# Altium project PCB_Project.PrjPcb
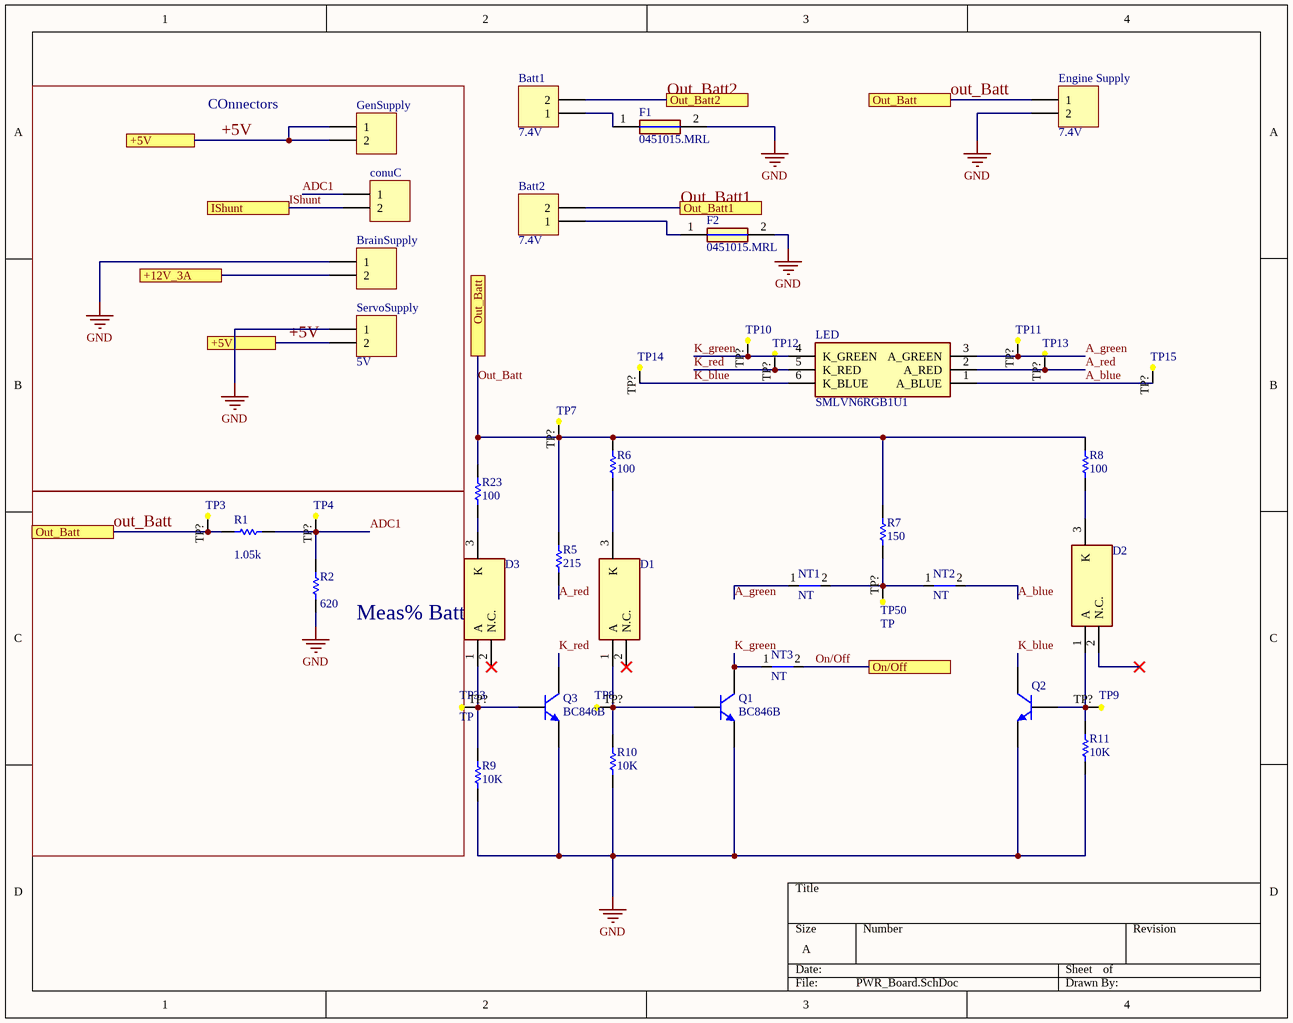
[diagram p0: PWR_Board.SchDoc]
4 sheets, 103 parts. Net scope: flat (ports and power ports of the same name join across sheets).
Board file: PWR_BOard_final.PcbDoc
Sheets:
  PWR_Board.SchDoc
  circuit-On-Off+loudspeaker.SchDoc
  buck_converter15A-5V.schdoc
  Balance_batt_protection.SchDoc

## Sheet PWR_Board.SchDoc
size A; SheetNumber: 5; SheetTotal: 5

### Parts
Batt1  7.4V  [PCBComponent_1 - duplicate]
Batt2  7.4V  [PCBComponent_1 - duplicate]
BrainSupply  6.1V-7.4V  [TB002V50002BE]  (value not drawn)
conuC  6.1V-7.4V  [TB002V50002BE]  (value not drawn)
D1  Vbr=6V2  [SOT65P210X110-3N]  (value not drawn)
D2  BZX84W-C15F  [SOT95P230X110-3N]  (value not drawn)
D3  Vbr=6V2  [SOT95P230X110-3N]  (value not drawn)
Engine_Supply  7.4V  [PCBComponent_1 - duplicate]
F1  0451015.MRL  [FUSC6127X294N]
F2  0451015.MRL  [FUSC6127X294N]
GenSupply  6.1V-7.4V  [TB002V50002BE]  (value not drawn)
LED  SMLVN6RGB1U1  [SMLVN6RGB1U1]
NT1  NT  [NetTie]  (net tie, no BOM)
NT2  NT  [NetTie]  (net tie, no BOM)
NT3  NT  [NetTie]  (net tie, no BOM)
Q1  BC846B  [SOT95P230X110-3N]
Q2  BC846B  [SOT95P230X110-3N]  (value not drawn)
Q3  BC846B  [SOT95P230X110-3N]
R1  value 1.05k  [RESC1608X55N]  (hidden comment: MCR03..PFX1051)
R2  value 620  [RESC1608X55N]  (hidden comment: MCR03...PFX7680)
R5  ERJ2RKF2150..: 215  [ERJ2RKD1004X]  (hidden comment: RK73H1JPT..2150F)
R6  value 100  [RESC1608X55N]  (hidden comment: MCR03..PFX1000)
R7  value 150  [SMM02040D1501BB300]  (hidden comment: SMM0204 50 150R 1 %)
R8  value 100  [RESC1608X55N]  (hidden comment: MCR03..PFX1000)
R9  value 10K  [RESC1608X55N]  (hidden comment: MCR03..PFX1002)
R10  value 10K  [RESC1608X55N]  (hidden comment: MCR03..PFX1002)
R11  value 10K  [RESC1608X55N]  (hidden comment: MCR03..PFX1002)
R23  value 100  [RESC1608X55N]  (hidden comment: MCR03..PFX1000)
ServoSupply  5V  [TB002V50002BE]
TP3  TP  [Test_Point0.5x0.5]  (value not drawn)
TP4  TP  [Test_Point0.5x0.5]  (value not drawn)
TP7  TP  [Test_Point0.5x0.5]  (value not drawn)
TP8  TP  [Test_Point0.5x0.5]  (value not drawn)
TP9  TP  [Test_Point0.5x0.5]  (value not drawn)
TP10  TP  [Test_Point0.5x0.5]  (value not drawn)
TP11  TP  [Test_Point0.5x0.5]  (value not drawn)
TP12  TP  [Test_Point0.5x0.5]  (value not drawn)
TP13  TP  [Test_Point0.5x0.5]  (value not drawn)
TP14  TP  [Test_Point0.5x0.5]  (value not drawn)
TP15  TP  [Test_Point0.5x0.5]  (value not drawn)
TP33  TP  [Test_Point0.5x0.5]
TP50  TP  [Test_Point0.5x0.5]

### Blocks framed on the sheet
COnnectors: BrainSupply conuC GenSupply ServoSupply
Meas% Batt: R1 R2 TP3 TP4

### Ports
+5V, +12V_3A, IShunt, On/Off, Out_Batt, Out_Batt1, Out_Batt2

### Nets
GND: BrainSupply.1 Engine_Supply.2 F1.2 F2.2 Q1.2(E) Q2.2(E) Q3.2(E) R2.2 R9.2 R10.2 R11.2 ServoSupply.1
+5V: GenSupply.1 GenSupply.2 ServoSupply.2 ; port +5V
A_blue: LED.1(A_BLUE) NT2.2 TP15.TP?(TP)
A_green: LED.3(A_GREEN) NT1.1 TP11.TP?(TP)
A_red: LED.2(A_RED) R5.2 TP13.TP?(TP)
ADC1: conuC.1 R1.1 R2.1 TP4.TP?(TP)
IShunt: conuC.2 ; port IShunt
K_blue: LED.6(K_BLUE) Q2.3(C) TP14.TP?(TP)
K_green: LED.4(K_GREEN) NT3.1 Q1.3(C) TP10.TP?(TP)
K_red: LED.5(K_RED) Q3.3(C) TP12.TP?(TP)
On/Off: NT3.2 ; port On/Off
out_Batt: Engine_Supply.1 R1.2 R5.1 R6.1 R7.1 R8.1 R23.1 TP3.TP?(TP) TP7.TP?(TP) ; port Out_Batt
Out_Batt1: Batt2.2 ; port Out_Batt1
Out_Batt2: Batt1.2 ; port Out_Batt2
NetBatt1_1: Batt1.1 F1.1
NetBatt2_1: Batt2.1 F2.1
NetBrainSupply_2: BrainSupply.2 ; port +12V_3A
NetD1_1: D1.1(A) Q1.1(B) R10.1 TP8.TP?(TP)
NetD1_3: D1.3(K) R6.2
NetD2_1: D2.1(A) Q2.1(B) R11.1 TP9.TP?(TP)
NetD2_3: D2.3(K) R8.2
NetD3_1: D3.1(A) Q3.1(B) R9.1 TP33.TP?(TP)
NetD3_3: D3.3(K) R23.2
NetNT1_2: NT1.2 NT2.1 R7.2 TP50.TP?(TP)

Not connected (* = marked no-connect by the designer): D1 2(N.C.)*; D2 2(N.C.)*; D3 2(N.C.)*

### Library data of the parts
Batt1 Batt2 Engine_Supply = Header 2: 2 Holes; LatestRevisionDate: 17-Jul-2002; LatestRevisionNote: Re-released for DXP Platform.; Publisher: Altium Limited
BrainSupply conuC GenSupply ServoSupply = Header 2: Header, 2-Pin; LatestRevisionDate: 17-Jul-2002; LatestRevisionNote: Re-released for DXP Platform.; Publisher: Altium Limited
D1-D3 = BZX84W-C15F: Zener Diode; Manufacturer_Name: Nexperia; Datasheet Link: https://assets.nexperia.com/documents/data-sheet/BZX84W_SER.pdf; Height: 1.1mm; Manufacturer_Part_Number: BZX84W-C15F; Mouser Part Number: 771-BZX84W-C15F; Mouser Price/Stock: https://www.mouser.co.uk/ProductDetail/Nexperia/BZX84W-C15F?qs=MLItCLRbWsyz6DhKLlcnOA%3D%3D; Arrow Part Number: BZX84W-C15F; Arrow Price/Stock: https://www.arrow.com/en/products/bzx84w-c15f/nexperia
F1 F2 = 0451015.MRL: Fuse; Manufacturer_Name: LITTELFUSE; Datasheet Link: http://www.littelfuse.com/~/media/electronics/datasheets/fuses/littelfuse_fuse_451_453_datasheet.pdf.pdf; Height: 2.94mm; Manufacturer_Part_Number: 0451015.MRL; Mouser Part Number: 576-0451015.MRL; Mouser Price/Stock: https://www.mouser.co.uk/ProductDetail/Littelfuse/0451015.MRL?qs=bpnLQM2ZShzZ87Rm5CvzLA%3D%3D; Arrow Part Number: 0451015.MRL; Arrow Price/Stock: https://www.arrow.com/en/products/0451015.mrl/littelfuse?region=europe
LED = SMLVN6RGB1U1: LED; Manufacturer_Name: ROHM Semiconductor; Datasheet Link: https://datasheet.datasheetarchive.com/originals/distributors/DKDS-18/357153.pdf; Height: 0.7mm; Manufacturer_Part_Number: SMLVN6RGB1U1; Mouser Part Number: 755-SMLVN6RGB1U1; Mouser Price/Stock: https://www.mouser.co.uk/ProductDetail/ROHM-Semiconductor/SMLVN6RGB1U1?qs=EAJhGnHnT01cATtJAsda5w%3D%3D; Arrow Part Number: SMLVN6RGB1U1; Arrow Price/Stock: https://www.arrow.com/en/products/smlvn6rgb1u1/rohm-semiconductor
NT1-NT3 = NetTie: Net Tie SMD
Q1-Q3 = NPN: NPN Bipolar Transistor; Published: 8-Jun-2000; LatestRevisionDate: 17-Jul-2002; LatestRevisionNote: Re-released for DXP Platform.; PackageReference: TO-226-AA; Publisher: Altium Limited; PackageDescription: TO, Flat Index; 3 In-Line, Axial Leads; Body Dia. 4.8mm; Leads 0.55 x 0.51 mm (max); Code_JEDEC: TO-226-AA
R1 R2 R5-R11 R23 = Res1: Resistor; Published: 8-Jun-2000; LatestRevisionDate: 17-Jul-2002; LatestRevisionNote: Re-released for DXP Platform.; PackageReference: AXIAL-0.3; Publisher: Altium Limited; PackageDescription: Axial Device, Thru-Hole; 2 Leads; 0.3 in Pin Spacing
TP3 TP4 TP7-TP15 TP33 TP50 = TEst_Point_0.5x0.5

## Sheet circuit-On-Off+loudspeaker.SchDoc
size A; SheetNumber: 4; SheetTotal: 5
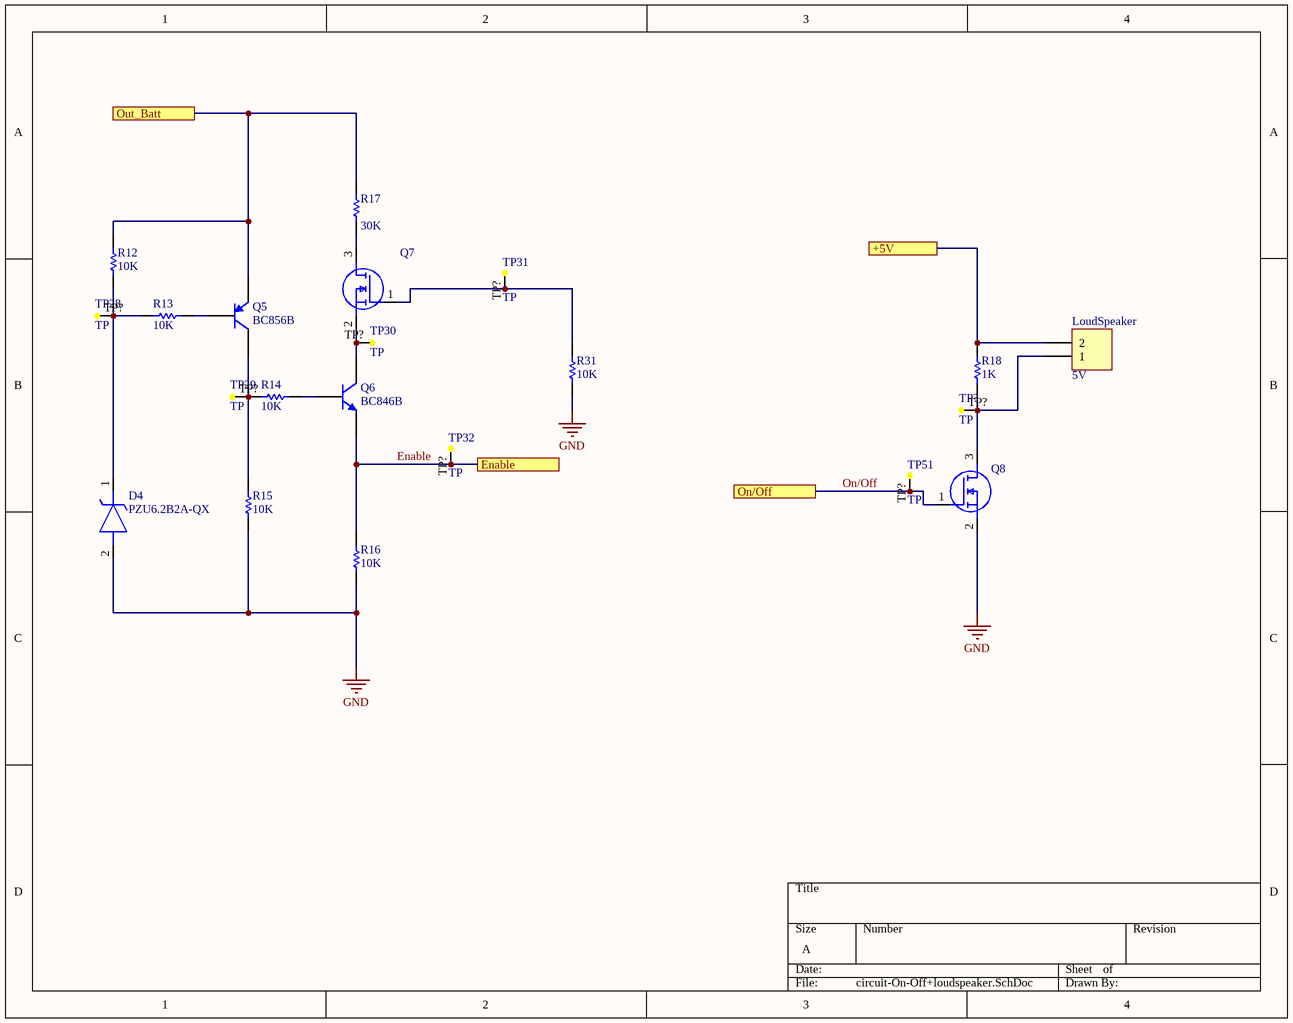
[diagram p1: circuit-On-Off+loudspeaker.SchDoc]

### Parts
D4  PZU6.2B2A-QX  [PZU62B2AQX]
LoudSpeaker  5V  [TB002V50002BE]
Q5  BC856B  [SOT95P230X110-3N]
Q6  BC846B  [SOT95P230X110-3N]
Q7  BSS138BK-215  [SOT95P230X110-3N]  (value not drawn)
Q8  BSS138BK-215  [SOT95P230X110-3N]  (value not drawn)
R12  value 10K  [RESC1608X55N]  (hidden comment: MCR03..PFX1002)
R13  value 10K  [RESC1608X55N]  (hidden comment: MCR03..PFX1002)
R14  value 10K  [RESC1608X55N]  (hidden comment: MCR03..PFX1002)
R15  value 10K  [RESC1608X55N]  (hidden comment: MCR03..PFX1002)
R16  value 10K  [RESC1608X55N]  (hidden comment: MCR03..PFX1002)
R17  value 30K  [ERJ2RKD1004X]  (hidden comment: 8909013012)
R18  value 1K  [ERJP06D1000V]  (hidden comment: MCR03..PFX1002)
R31  value 10K  [RESC1608X55N]  (hidden comment: MCR03..PFX1002)
TP28  TP  [Test_Point0.5x0.5]
TP29  TP  [Test_Point0.5x0.5]
TP30  TP  [Test_Point0.5x0.5]
TP31  TP  [Test_Point0.5x0.5]
TP32  TP  [Test_Point0.5x0.5]
TP51  TP  [Test_Point0.5x0.5]
TP?  TP  [Test_Point0.5x0.5]

### Ports
+5V, Enable, On/Off, Out_Batt

### Nets
GND: D4.2(A) Q8.2(S) R15.2 R16.2 R31.2
+5V: LoudSpeaker.2 R18.1 ; port +5V
Enable: Q6.2(E) R16.1 TP32.TP?(TP) ; port Enable
On/Off: Q8.1(G) TP51.TP?(TP) ; port On/Off
out_Batt: Q5.2(E) R12.1 R17.2 ; port Out_Batt
NetD4_1: D4.1(K) R12.2 R13.1 TP28.TP?(TP)
NetLoudSpeaker_1: LoudSpeaker.1 Q8.3(D) R18.2 TP?.TP?(TP)
NetQ5_1: Q5.1(B) R13.2
NetQ5_3: Q5.3(C) R14.1 R15.1 TP29.TP?(TP)
NetQ6_1: Q6.1(B) R14.2
NetQ6_3: Q6.3(C) Q7.2(S) TP30.TP?(TP)
NetQ7_1: Q7.1(G) R31.1 TP31.TP?(TP)
NetQ7_3: Q7.3(D) R17.1

### Library data of the parts
D4 = PZU6.2B2A-QX: Zener Diode; Manufacturer_Name: Nexperia; Datasheet Link: https://assets.nexperia.com/documents/data-sheet/PZUXBA-Q_SER.pdf; Height: 1.1mm; Manufacturer_Part_Number: PZU6.2B2A-QX
LoudSpeaker = Header 2: Header, 2-Pin; LatestRevisionDate: 17-Jul-2002; LatestRevisionNote: Re-released for DXP Platform.; Publisher: Altium Limited
Q5 = PNP: PNP Bipolar Transistor; Published: 8-Jun-2000; LatestRevisionDate: 29-May-2009; LatestRevisionNote: IPC-7351 Footprint Added.; PackageVersion: Aug-1999; PackageReference: SOT-23B; Publisher: Altium Limited; PackageDescription: 3-Pin SOT-23 Package 0.95 mm Pitch, 2.4 mm Lead Span
Q6 = NPN: NPN Bipolar Transistor; Published: 8-Jun-2000; LatestRevisionDate: 17-Jul-2002; LatestRevisionNote: Re-released for DXP Platform.; PackageReference: TO-226-AA; Publisher: Altium Limited; PackageDescription: TO, Flat Index; 3 In-Line, Axial Leads; Body Dia. 4.8mm; Leads 0.55 x 0.51 mm (max); Code_JEDEC: TO-226-AA
Q7 Q8 = BSS138BK-215: MOSFET (N-Channel); Manufacturer_Name: Nexperia; Datasheet Link: https://assets.nexperia.com/documents/data-sheet/BSS138BK.pdf; Height: 1.1mm; Manufacturer_Part_Number: BSS138BK-215
R12-R18 R31 = Res1: Resistor; Published: 8-Jun-2000; LatestRevisionDate: 17-Jul-2002; LatestRevisionNote: Re-released for DXP Platform.; PackageReference: AXIAL-0.3; Publisher: Altium Limited; PackageDescription: Axial Device, Thru-Hole; 2 Leads; 0.3 in Pin Spacing
TP28-TP32 TP51 TP? = TEst_Point_0.5x0.5

## Sheet buck_converter15A-5V.schdoc
size 515 x 121 mm; SheetNumber: 4; SheetTotal: 5
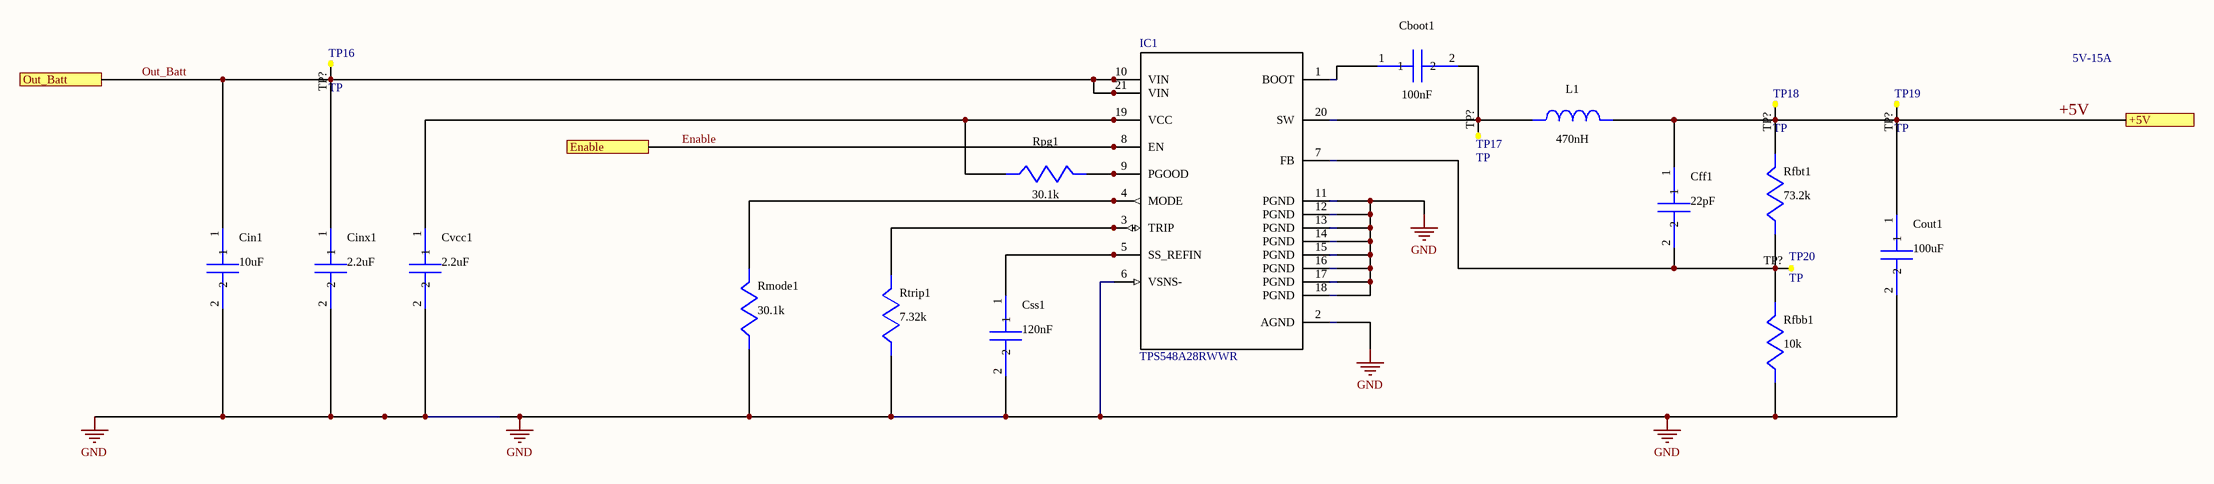
[diagram p2: buck_converter15A-5V.schdoc]

### Parts
Cboot1  value 100nF  [CAPC1005X55N]  (hidden comment: EMK105 B7104KVHF)
Cff1  C1005C0G1H220J: 22pF  [CAPC1005X55N]  (hidden comment: C1005C0G1H220J)
Cin1  value 10uF  [CAPC3216X200N]  (hidden comment: GCJ31CC71E106K)
Cinx1  value 2.2uF  [CAPC1608X80N]  (hidden comment: GCM188C71A225K)
Cout1  value 100uF  [CAPC3225X270N]  (hidden comment: EMK325ABJ107MM-T)
Css1  value 120nF  [CAPC1005X55N]  (hidden comment: C1608X7R1H154K)
Cvcc1  value 2.2uF  [CAPC1608X80N]  (hidden comment: GCM188C71A225K)
IC1  TPS548A28RWWR  [RWW0021A]
L1  value 470nH  [IHLP4040DZERR47M11]  (hidden comment: IHLP4040DZERR47M11)
Rfbb1  value 10k  [SMM02040D1501BB300]  (hidden comment: SMM0204 50 10K 1 %)
Rfbt1  value 73.2k  [ERJ2RKD1004X]  (hidden comment: SMM0204 50 73K2 1 %)
Rmode1  value 30.1k  [SMM02040D1501BB300]  (hidden comment: SMM0204 50 30K1 1 %)
Rpg1  value 30.1k  [SMM02040D1501BB300]  (hidden comment: SMM0204 50 30K1 1 %)
Rtrip1  value 7.32k  [ERJ2RKD1004X]  (hidden comment: SMM0204 50 7K32 1 %)
TP16  TP  [Test_Point0.5x0.5]
TP17  TP  [Test_Point0.5x0.5]
TP18  TP  [Test_Point0.5x0.5]
TP19  TP  [Test_Point0.5x0.5]
TP20  TP  [Test_Point0.5x0.5]

### Ports
+5V, Enable, Out_Batt

### Nets
GND: Cin1.2 Cinx1.2 Cout1.2 Css1.2 Cvcc1.2 IC1.2(AGND) IC1.6(VSNS-) IC1.11(PGND) IC1.12(PGND) IC1.13(PGND) IC1.14(PGND) IC1.15(PGND) IC1.16(PGND) IC1.17(PGND) IC1.18(PGND) Rfbb1.2 Rmode1.2 Rtrip1.2
+5V: Cff1.1 Cout1.1 L1.1 Rfbt1.1 TP18.TP?(TP) TP19.TP?(TP) ; port +5V
Enable: IC1.8(EN) ; port Enable
out_Batt: Cin1.1 Cinx1.1 IC1.10(VIN) IC1.21(VIN) TP16.TP?(TP) ; port Out_Batt
NetCboot1_1: Cboot1.1 IC1.1(BOOT)
NetCboot1_2: Cboot1.2 IC1.20(SW) L1.2 TP17.TP?(TP)
NetCff1_2: Cff1.2 IC1.7(FB) Rfbb1.1 Rfbt1.2 TP20.TP?(TP)
NetCss1_1: Css1.1 IC1.5(SS_REFIN)
NetCvcc1_1: Cvcc1.1 IC1.19(VCC) Rpg1.2
NetIC1_3: IC1.3(TRIP) Rtrip1.1
NetIC1_4: IC1.4(MODE) Rmode1.1
NetIC1_9: IC1.9(PGOOD) Rpg1.1

### Notes on the sheet
- 5V-15A

### Library data of the parts
Cboot1 = EMK107B7104KA-T: Manufacturer Name: Taiyo Yuden; PackageReference: EMK107B7104KA-T; Manufacturer Part Number: EMK107B7104KA-T
Cff1 = C0402C240J3GACTU: Manufacturer Name: Kemet; PackageReference: C0402C240J3GACTU; Manufacturer Part Number: C0402C240J3GACTU
Cin1 = GRM31CR71E106KA12L: GRM31CR71E106KA1; Manufacturer Name: MuRata; PackageReference: GRM31CR71E106KA12L; Manufacturer Part Number: GRM31CR71E106KA12L
Cinx1 = C1608X7R1A225K080AC: C1608X7R1A225K08; Manufacturer Name: TDK; PackageReference: C1608X7R1A225K080AC; Manufacturer Part Number: C1608X7R1A225K080AC
Cout1 = GENERIC_CAPACITOR: CUSTOM1; Manufacturer Name: CUSTOM; PackageReference: CUSTOM; Manufacturer Part Number: GENERIC_CAPACITOR
Css1 = GRM155R61A124KE19D: GRM155R61A124KE1; Manufacturer Name: MuRata; PackageReference: GRM155R61A124KE19D; Manufacturer Part Number: GRM155R61A124KE19D
Cvcc1 = GRM188R71A225KE15D: GRM188R71A225KE1; Manufacturer Name: MuRata; PackageReference: GRM188R71A225KE15D; Manufacturer Part Number: GRM188R71A225KE15D
IC1 = TPS548A28RWWR: No Description Available; Manufacturer: Texas Instruments; PartNumber: TPS548A28RWWR; RefDes: RefDes; TYPE: TYPE; Value: Value; Manufacturer_Part_Number: TPS548A28RWWR; Manufacturer_Name: Texas Instruments; Copyright: Copyright (C) 2018 Accelerated Designs. All rights reserved
L1 = IHLP4040DZERR47M11: IHLP4040DZERR47M; Manufacturer Name: Vishay-Dale; PackageReference: IHLP4040DZERR47M11; Manufacturer Part Number: IHLP4040DZERR47M11
Rfbb1 = CRCW040210K0FKED: Manufacturer Name: Vishay-Dale; PackageReference: CRCW040210K0FKED; Manufacturer Part Number: CRCW040210K0FKED
Rfbt1 = CRCW040273K2FKED: Manufacturer Name: Vishay-Dale; PackageReference: CRCW040273K2FKED; Manufacturer Part Number: CRCW040273K2FKED
Rmode1 Rpg1 = CRCW040230K1FKED: Manufacturer Name: Vishay-Dale; PackageReference: CRCW040230K1FKED; Manufacturer Part Number: CRCW040230K1FKED
Rtrip1 = CRCW04027K32FKED: Manufacturer Name: Vishay-Dale; PackageReference: CRCW04027K32FKED; Manufacturer Part Number: CRCW04027K32FKED
TP16-TP20 = TEst_Point_0.5x0.5

## Sheet Balance_batt_protection.SchDoc
size A; SheetNumber: 1; SheetTotal: 5
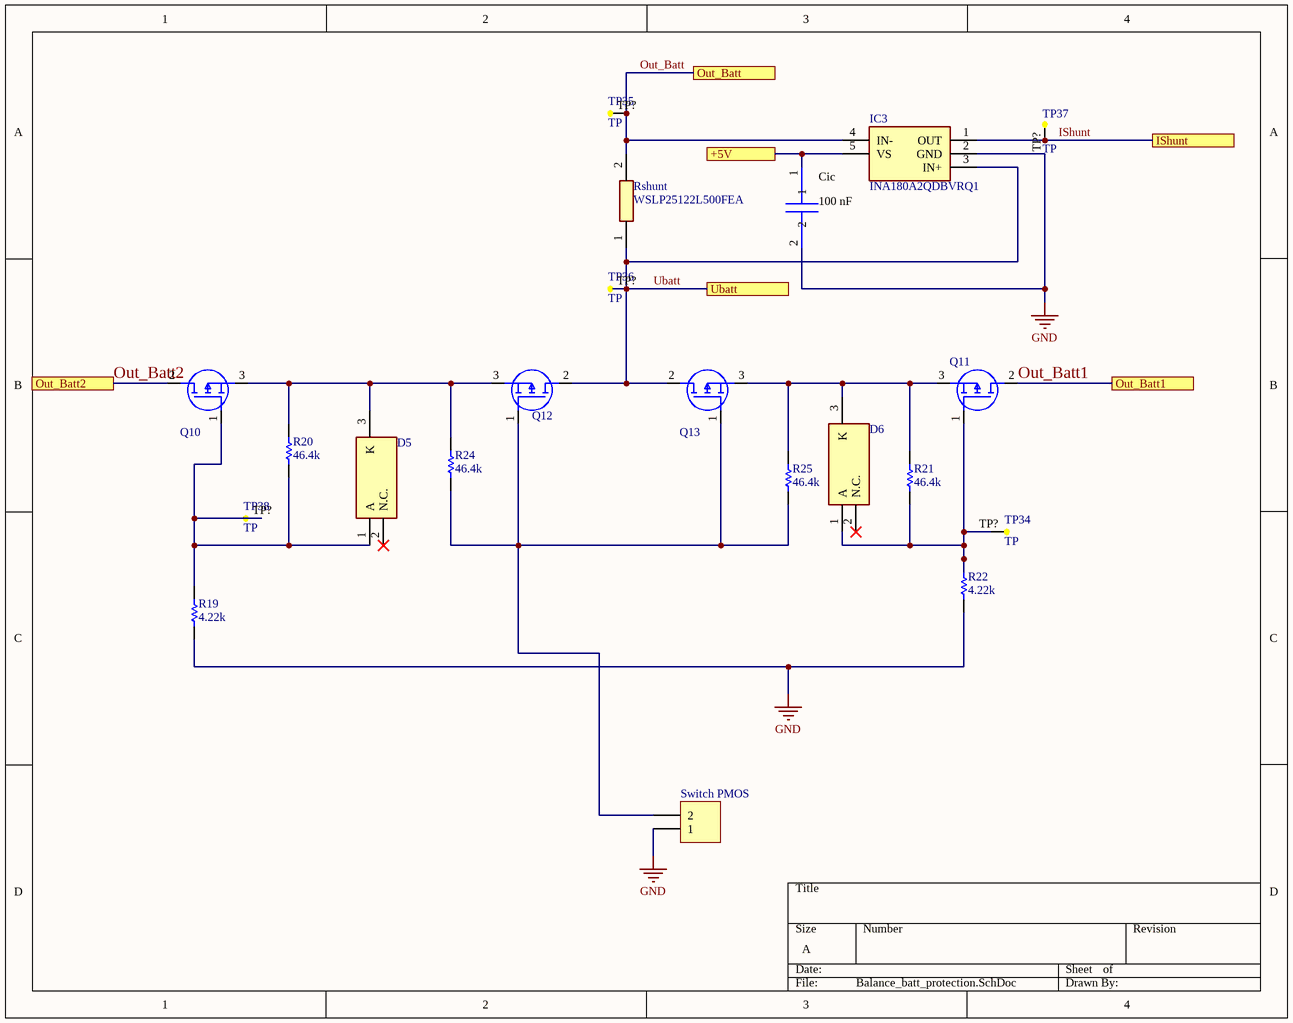
[diagram p3: Balance_batt_protection.SchDoc]

### Parts
Cic  value 100 nF  [CAPC1005X55N]  (hidden comment: C2012X7S1C106K)
D5  SZBZX84C18ET1G  [SOT95P230X110-3N]  (value not drawn)
D6  SZBZX84C18ET1G  [SOT95P230X110-3N]  (value not drawn)
IC3  INA180A2QDBVRQ1  [SOT95P280X145-5N]
Q10  SQD50P04-09L_GE3  [SQD50P0409L_GE3]  (value not drawn)
Q11  SQD50P04-09L_GE3  [SQD50P0409L_GE3]  (value not drawn)
Q12  SQD50P04-09L_GE3  [SQD50P0409L_GE3]  (value not drawn)
Q13  SQD50P04-09L_GE3  [SQD50P0409L_GE3]  (value not drawn)
R19  value 4.22k  [ERJP06D1000V]  (hidden comment: MCR03..PFX1002)
R20  value 46.4k  [RESC1608X55N]  (hidden comment: MCR03..PFX1002)
R21  value 46.4k  [RESC1608X55N]  (hidden comment: MCR03..PFX1002)
R22  value 4.22k  [ERJP06D1000V]  (hidden comment: MCR03..PFX1002)
R24  value 46.4k  [RESC1608X55N]  (hidden comment: MCR03..PFX1002)
R25  value 46.4k  [RESC1608X55N]  (hidden comment: MCR03..PFX1002)
Rshunt  WSLP25122L500FEA  [RESC6432X89N]
Switch_PMOS  5V  [TB002V50002BE]  (value not drawn)
TP34  TP  [Test_Point0.5x0.5]
TP35  TP  [Test_Point0.5x0.5]
TP36  TP  [Test_Point0.5x0.5]
TP37  TP  [Test_Point0.5x0.5]
TP38  TP  [Test_Point0.5x0.5]

### Ports
+5V, IShunt, Out_Batt, Out_Batt1, Out_Batt2, Ubatt

### Nets
GND: Cic.2 IC3.2(GND) R19.2 R22.2 Switch_PMOS.1
+5V: Cic.1 IC3.5(VS) ; port +5V
IShunt: IC3.1(OUT) TP37.TP?(TP) ; port IShunt
out_Batt: IC3.4(IN-) Rshunt.2 TP35.TP?(TP) ; port Out_Batt
Out_Batt1: Q11.2(D) ; port Out_Batt1
Out_Batt2: Q10.2(D) ; port Out_Batt2
Ubatt: IC3.3(IN+) Q12.2(D) Q13.2(D) Rshunt.1 TP36.TP?(TP) ; port Ubatt
NetD5_1: D5.1(A) Q10.1(G) R19.1 R20.2 TP38.TP?(TP)
NetD5_3: D5.3(K) Q10.3(S) Q12.3(S) R20.1 R24.1
NetD6_1: D6.1(A) Q11.1(G) R21.2 R22.1 TP34.TP?(TP)
NetD6_3: D6.3(K) Q11.3(S) Q13.3(S) R21.1 R25.1
NetQ12_1: Q12.1(G) Q13.1(G) R24.2 R25.2 Switch_PMOS.2

Not connected (* = marked no-connect by the designer): D5 2(N.C.)*; D6 2(N.C.)*

### Library data of the parts
Cic = C3216X6S1V106K160AC: C3216X6S1V106K16; Manufacturer Name: TDK; PackageReference: C3216X6S1V106K160AC; Manufacturer Part Number: C3216X6S1V106K160AC
D5 D6 = BZX84W-C15F: Zener Diode; Manufacturer_Name: Nexperia; Datasheet Link: https://assets.nexperia.com/documents/data-sheet/BZX84W_SER.pdf; Height: 1.1mm; Manufacturer_Part_Number: BZX84W-C15F; Mouser Part Number: 771-BZX84W-C15F; Mouser Price/Stock: https://www.mouser.co.uk/ProductDetail/Nexperia/BZX84W-C15F?qs=MLItCLRbWsyz6DhKLlcnOA%3D%3D; Arrow Part Number: BZX84W-C15F; Arrow Price/Stock: https://www.arrow.com/en/products/bzx84w-c15f/nexperia
IC3 = INA180A2QDBVRQ1: Attenuator or Isolator; Manufacturer_Name: Texas Instruments; Datasheet Link: http://www.ti.com/lit/gpn/INA180-Q1; Height: 1.45mm; Manufacturer_Part_Number: INA180A2QDBVRQ1; Mouser Part Number: 595-INA180A2QDBVRQ1; Mouser Price/Stock: https://www.mouser.co.uk/ProductDetail/Texas-Instruments/INA180A2QDBVRQ1?qs=9r4v7xj2LnnPs8OEye75UA%3D%3D; Arrow Part Number: INA180A2QDBVRQ1; Arrow Price/Stock: https://www.arrow.com/en/products/ina180a2qdbvrq1/texas-instruments?region=nac
Q10-Q13 = SQD50P04-09L_GE3: MOSFET (P-Channel); Manufacturer_Name: Vishay; Datasheet Link: https://www.vishay.com/docs/65018/sqd50p04.pdf; Height: 2.28mm; Manufacturer_Part_Number: SQD50P04-09L_GE3; Mouser Part Number: 78-SQD50P04-09L_GE3; Mouser Price/Stock: https://www.mouser.co.uk/ProductDetail/Vishay-Siliconix/SQD50P04-09L_GE3?qs=jHkklCh7amiWGBpNycQWww%3D%3D
R19-R22 R24 R25 = Res1: Resistor; Published: 8-Jun-2000; LatestRevisionDate: 17-Jul-2002; LatestRevisionNote: Re-released for DXP Platform.; PackageReference: AXIAL-0.3; Publisher: Altium Limited; PackageDescription: Axial Device, Thru-Hole; 2 Leads; 0.3 in Pin Spacing
Rshunt = WSLP25122L500FEA: Resistor; Manufacturer_Name: Vishay; Datasheet Link: https://componentsearchengine.com/Datasheets/1/WSLP25122L500FEA.pdf; Height: 0.889mm; Manufacturer_Part_Number: WSLP25122L500FEA; Mouser Part Number: 71-WSLP25122L500FEA; Mouser Price/Stock: https://www.mouser.co.uk/ProductDetail/Vishay-Dale/WSLP25122L500FEA?qs=%2FCXICPRLKg%252BpcyljWM%2FHhA%3D%3D; Arrow Part Number: WSLP25122L500FEA; Arrow Price/Stock: https://www.arrow.com/en/products/wslp25122l500fea/vishay
Switch_PMOS = Header 2: Header, 2-Pin; LatestRevisionDate: 17-Jul-2002; LatestRevisionNote: Re-released for DXP Platform.; Publisher: Altium Limited
TP34-TP38 = TEst_Point_0.5x0.5

## Nets that join several sheets
GND: PWR_Board (12 pins), circuit-On-Off+loudspeaker (5 pins), buck_converter15A-5V (18 pins), Balance_batt_protection (5 pins)
+5V: PWR_Board (GenSupply.1 GenSupply.2 ServoSupply.2), circuit-On-Off+loudspeaker (LoudSpeaker.2 R18.1), buck_converter15A-5V (6 pins), Balance_batt_protection (Cic.1 IC3.5)
Enable: circuit-On-Off+loudspeaker (Q6.2 R16.1 TP32.TP?), buck_converter15A-5V (IC1.8)
IShunt: PWR_Board (conuC.2), Balance_batt_protection (IC3.1 TP37.TP?)
On/Off: PWR_Board (NT3.2), circuit-On-Off+loudspeaker (Q8.1 TP51.TP?)
out_Batt: PWR_Board (9 pins), circuit-On-Off+loudspeaker (Q5.2 R12.1 R17.2), buck_converter15A-5V (5 pins), Balance_batt_protection (IC3.4 Rshunt.2 TP35.TP?)
Out_Batt1: PWR_Board (Batt2.2), Balance_batt_protection (Q11.2)
Out_Batt2: PWR_Board (Batt1.2), Balance_batt_protection (Q10.2)